# Altium schematic sheet STM32F103RCT6_Core.SchDoc
size A4
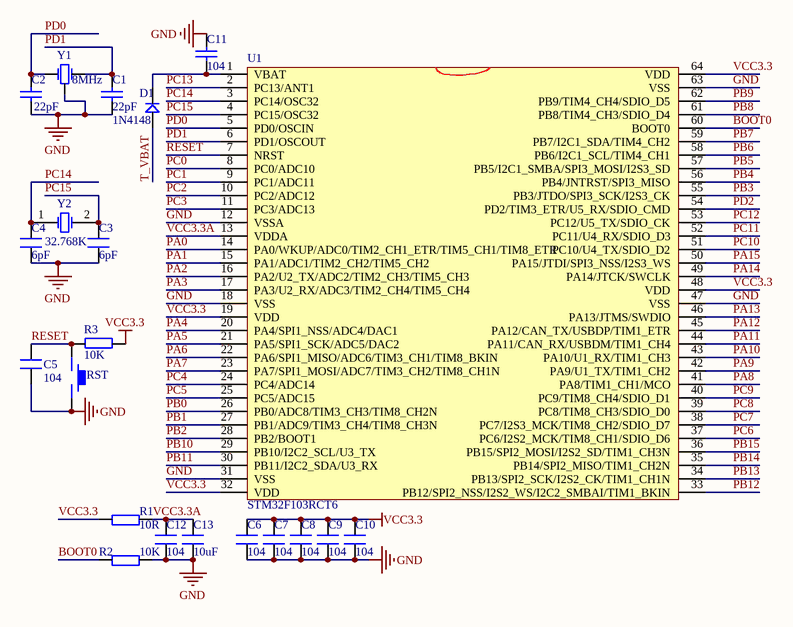
[diagram p0: STM32F103RCT6_Core.SchDoc]

## Parts
C1  22pF  [C 0603_M]
C2  22pF  [C 0603_M]
C3  6pF  [C 0603_M]
C4  6pF  [C 0603_M]
C5  104  [C 0603_M]
C6  104  [C 0603_M]
C7  104  [C 0603_M]
C8  104  [C 0603_M]
C9  104  [C 0603_M]
C10  104  [C 0603_M]
C11  104  [C 0603_M]
C12  104  [C 0603_M]
C13  10uF  [C 0603_M]
D1  1N4148  [MINI_MELF (LL34)]
R1  10R  [R 0603_M]
R2  10K  [R 0603_M]
R3  10K  [R 0603_M]
RST  S-KEY-SMD-324225  [TSW SMD-3*6*2.5]  (value not drawn)
U1  STM32F103RCT6  [LQFP-64N]
Y1  8MHz  [Y-XTAL-3215-3P]
Y2  32.768K  [OSC 3215-2P]

## Nets
GND: C1.1 C2.1 C3.1 C4.1 C5.1 C6.1 C7.1 C8.1 C9.1 C10.1 C11.1 C12.1 C13.1 R2.2 RST.2 U1.12(VSSA) U1.18(VSS) U1.31(VSS) U1.47(VSS) U1.63(VSS) Y1.2(GND)
VCC3.3: C6.2 C7.2 C8.2 C9.2 C10.2 R1.1 R3.1 U1.19(VDD) U1.32(VDD) U1.48(VDD) U1.64(VDD)
BOOT0: R2.1 U1.60(BOOT0)
PA0: U1.14(PA0/WKUP/ADC0/TIM2_CH1_ETR/TIM5_CH1/TIM8_ETR)
PA1: U1.15(PA1/ADC1/TIM2_CH2/TIM5_CH2)
PA2: U1.16(PA2/U2_TX/ADC2/TIM2_CH3/TIM5_CH3)
PA3: U1.17(PA3/U2_RX/ADC3/TIM2_CH4/TIM5_CH4)
PA4: U1.20(PA4/SPI1_NSS/ADC4/DAC1)
PA5: U1.21(PA5/SPI1_SCK/ADC5/DAC2)
PA6: U1.22(PA6/SPI1_MISO/ADC6/TIM3_CH1/TIM8_BKIN)
PA7: U1.23(PA7/SPI1_MOSI/ADC7/TIM3_CH2/TIM8_CH1N)
PA8: U1.41(PA8/TIM1_CH1/MCO)
PA9: U1.42(PA9/U1_TX/TIM1_CH2)
PA10: U1.43(PA10/U1_RX/TIM1_CH3)
PA11: U1.44(PA11/CAN_RX/USBDM/TIM1_CH4)
PA12: U1.45(PA12/CAN_TX/USBDP/TIM1_ETR)
PA13: U1.46(PA13/JTMS/SWDIO)
PA14: U1.49(PA14/JTCK/SWCLK)
PA15: U1.50(PA15/JTDI/SPI3_NSS/I2S3_WS)
PB0: U1.26(PB0/ADC8/TIM3_CH3/TIM8_CH2N)
PB1: U1.27(PB1/ADC9/TIM3_CH4/TIM8_CH3N)
PB2: U1.28(PB2/BOOT1)
PB3: U1.55(PB3/JTDO/SPI3_SCK/I2S3_CK)
PB4: U1.56(PB4/JNTRST/SPI3_MISO)
PB5: U1.57(PB5/I2C1_SMBA/SPI3_MOSI/I2S3_SD)
PB6: U1.58(PB6/I2C1_SCL/TIM4_CH1)
PB7: U1.59(PB7/I2C1_SDA/TIM4_CH2)
PB8: U1.61(PB8/TIM4_CH3/SDIO_D4)
PB9: U1.62(PB9/TIM4_CH4/SDIO_D5)
PB10: U1.29(PB10/I2C2_SCL/U3_TX)
PB11: U1.30(PB11/I2C2_SDA/U3_RX)
PB12: U1.33(PB12/SPI2_NSS/I2S2_WS/I2C2_SMBAI/TIM1_BKIN)
PB13: U1.34(PB13/SPI2_SCK/I2S2_CK/TIM1_CH1N)
PB14: U1.35(PB14/SPI2_MISO/TIM1_CH2N)
PB15: U1.36(PB15/SPI2_MOSI/I2S2_SD/TIM1_CH3N)
PC0: U1.8(PC0/ADC10)
PC1: U1.9(PC1/ADC11)
PC2: U1.10(PC2/ADC12)
PC3: U1.11(PC3/ADC13)
PC4: U1.24(PC4/ADC14)
PC5: U1.25(PC5/ADC15)
PC6: U1.37(PC6/I2S2_MCK/TIM8_CH1/SDIO_D6)
PC7: U1.38(PC7/I2S3_MCK/TIM8_CH2/SDIO_D7)
PC8: U1.39(PC8/TIM8_CH3/SDIO_D0)
PC9: U1.40(PC9/TIM8_CH4/SDIO_D1)
PC10: U1.51(PC10/U4_TX/SDIO_D2)
PC11: U1.52(PC11/U4_RX/SDIO_D3)
PC12: U1.53(PC12/U5_TX/SDIO_CK)
PC13: U1.2(PC13/ANT1)
PC14: C4.2 U1.3(PC14/OSC32) Y2.1(OSC1)
PC15: C3.2 U1.4(PC15/OSC32) Y2.2(OSC2)
PD0: C2.2 U1.5(PD0/OSCIN) Y1.1(OSC1)
PD1: C1.2 U1.6(PD1/OSCOUT) Y1.3(OSC2)
PD2: U1.54(PD2/TIM3_ETR/U5_RX/SDIO_CMD)
RESET: C5.2 R3.2 RST.1 U1.7(NRST)
T_VBAT: D1.1
VCC3.3A: C12.2 C13.2 R1.2 U1.13(VDDA)
NetC11_2: C11.2 D1.2 U1.1(VBAT)

## Library data of the parts
C1 C2 C11 = CAP
C3-C10 C12 C13 = C
D1 = D
R1-R3 = R
RST = S-KEY-SMD-324225: KEY,SMD,324225
U1 = STM32F103RDT6
Y1 = Y-3215-8M: XTAL,3215,8MHz
Y2 = XTAL: Crystal Oscillator; Published: 8-Jun-2000; LatestRevisionDate: 17-Jul-2002; LatestRevisionNote: Re-released for DXP Platform.; Publisher: Altium Limited